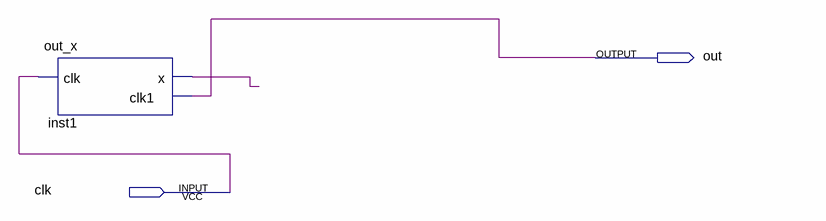
[diagram p0: schematic sheet]
// Quartus schematic Block1.bdf as structural Verilog: 1 symbols, 2 pins
module Block1 (
  input  clk,
  output out
);

  wire inst1_x;

  out_x inst1 (.clk(clk), .x(inst1_x), .clk1(out));
endmodule
